# Altium schematic sheet SPD.SchDoc
size A; SheetNumber: 10; SheetTotal: 11
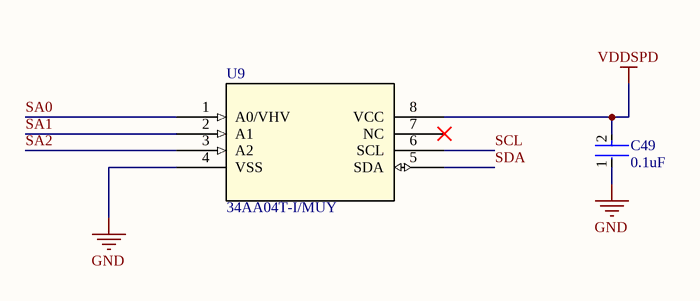
[diagram p0: SPD.SchDoc]

## Parts
C49  0.1uF  [FP-GRM15-MFG]
U9  34AA04T-I/MUY  [UDFN8_2x3MC_MCH]

## Nets
GND: C49.1 U9.4(VSS)
VDDSPD: C49.2 U9.8(VCC)
SA0: U9.1(A0/VHV)
SA1: U9.2(A1)
SA2: U9.3(A2)
SCL: U9.6(SCL)
SDA: U9.5(SDA)

Not connected (* = marked no-connect by the designer): U9 7(NC)*

## Library data of the parts
C49 = CMP-2100-03641-2: CAP CER 0.1UF 16V X7R 0402; Manufacturer Part Number: GRM155R71C104KA88D; Manufacturer: Murata; Standoff Height: 0mm; Tolerance: 10%; Voltage Rating: 16Vdc; Material: Ceramic; Capacitance: 0.10μF; Value: 0.10μF; RoHS: TRUE; Temperature Characteristic: X7R; Octopart: https://octopart.com/grm155r71c104ka88d-murata-196880; Digikey Description: CAP CER 0.1UF 16V X7R 0402; Device Class L3: Ceramic Capacitors; Height: 0.55mm; ComponentLink2Description: Datasheet; Temperature Range Low: -55°C; Ipc Land Pattern Name: CAPC10050X219; ComponentLink2URL: https://search.murata.co.jp/Ceramy/image/img/A01X/G101/ENG/GRM155R71H471KA01-01A.pdf; Device Class L1: Passive Components; Lead Free: yes; Category: Cap; Package: GRM15; Temperature: -55°C to +125°C; Device Class L2: Capacitors; Temperature Range High: +125°C; Mouser Description: 0402 0.1 uF 16V ±10 % Tolerance X7R SMT Multilayer Ceramic Capacitor
U9 = 34AA04T-IMUY: No Description Available; Manufacturer_Name: Microchip; Copyright: Copyright (C) 2026 Ultra Librarian. All rights reserved.; Manufacturer_Part_Number: 34AA04T-I/MUY; RefDes: RefDes; Type: Type